# Altium schematic sheet DivisorPotResistva.SchDoc
size A4
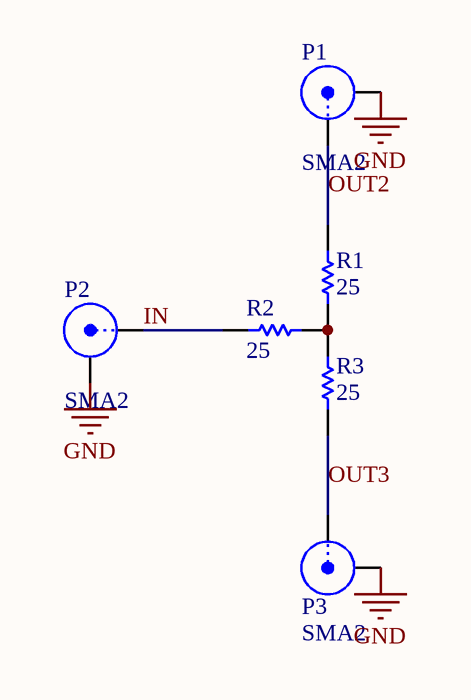
[diagram p0: DivisorPotResistva.SchDoc]

## Parts
P1  SMA2  [SMAL2]
P2  SMA2  [SMAL2]
P3  SMA2  [SMAL2]
R1  value 25  [0805_RES]  (hidden comment: Resistor)
R2  value 25  [0805_RES]  (hidden comment: Resistor)
R3  value 25  [0805_RES]  (hidden comment: Resistor)

## Nets
GND: P1.0(Y) P2.0(Y) P3.0(Y)
IN: P2.1(X) R2.1
OUT2: P1.1(X) R1.2
OUT3: P3.1(X) R3.1
NetR1_1: R1.1 R2.2 R3.2

## Library data of the parts
P1-P3 = SMA2: BNC Elbow Connector; LatestRevisionDate: 17-Jul-2002; LatestRevisionNote: Re-released for DXP Platform.; Publisher: Altium Limited
R1-R3 = Res